# Altium schematic sheet ad_1.schdoc
size A3
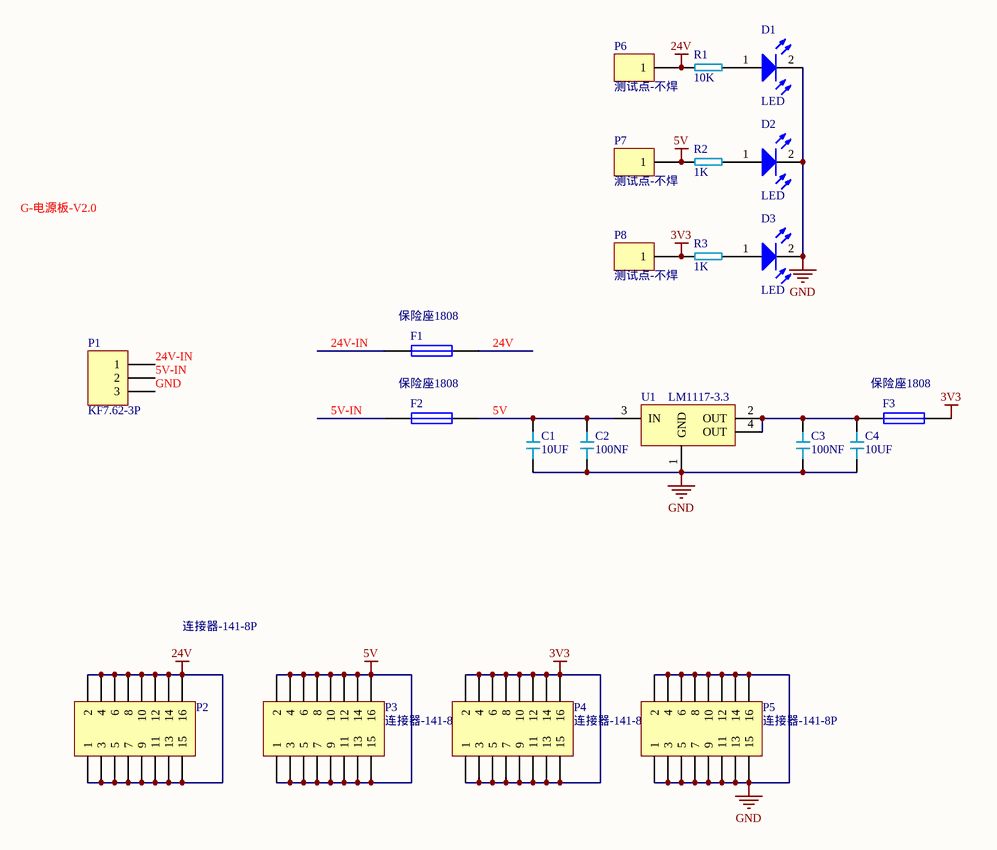
[diagram p0: ad_1.schdoc]

## Parts
C1  10UF  [C0603]
C2  100NF  [C0603]
C3  100NF  [C0603]
C4  10UF  [C0603]
D1  LED  [LED0603]
D2  LED  [LED0603]
D3  LED  [LED0603]
F1  保险座1808  [F1808-ZUO]
F2  保险座1808  [F1808-ZUO]
F3  保险座1808  [F1808-ZUO]
P1  KF7.62-3P  [KF7620-3P]
P2  连接器-141-8P  [141V-8P]
P3  连接器-141-8P  [141V-8P]
P4  连接器-141-8P  [141V-8P]
P5  连接器-141-8P  [141V-8P]
P6  测试点-不焊  [test]
P7  测试点-不焊  [test]
P8  测试点-不焊  [test]
R1  10K  [R0603]
R2  1K  [R0603]
R3  1K  [R0603]
U1  LM1117-3.3  [SOT223]

## Nets
3V3: F3.2 P4.1 P4.2 P4.3 P4.4 P4.5 P4.6 P4.7 P4.8 P4.9 P4.10 P4.11 P4.12 P4.13 P4.14 P4.15 P4.16 P8.1 R3.1
5V: C1.2 C2.2 F2.2 P3.1 P3.2 P3.3 P3.4 P3.5 P3.6 P3.7 P3.8 P3.9 P3.10 P3.11 P3.12 P3.13 P3.14 P3.15 P3.16 P7.1 R2.1 U1.3(IN)
24V: F1.2 P2.1 P2.2 P2.3 P2.4 P2.5 P2.6 P2.7 P2.8 P2.9 P2.10 P2.11 P2.12 P2.13 P2.14 P2.15 P2.16 P6.1 R1.1
GND: C1.1 C2.1 C3.1 C4.1 D1.2(K) D2.2(K) D3.2(K) P1.3 P5.1 P5.2 P5.3 P5.4 P5.5 P5.6 P5.7 P5.8 P5.9 P5.10 P5.11 P5.12 P5.13 P5.14 P5.15 P5.16 U1.1(GND)
5V-IN: F2.1 P1.2
24V-IN: F1.1 P1.1
NetC3_2: C3.2 C4.2 F3.1 U1.2(OUT) U1.4(OUT)
NetD1_1: D1.1(A) R1.2
NetD2_1: D2.1(A) R2.2
NetD3_1: D3.1(A) R3.2

## Notes on the sheet
- Labels drawn without touching a wire or pin: G-电源板-V2.0

## Library data of the parts
C1-C4 = C0603: 贴片电容
D1-D3 = LED0603: Published: 8-Jun-2000; LatestRevisionDate: 08-Jul-2005; LatestRevisionNote: Mech Layer 1 removed.; PackageReference: LED-0; Publisher: Altium Limited; PackageDescription: LED; 2 Leads
F1-F3 = Fuse0805: 保险座; Published: 8-Jun-2000; LatestRevisionDate: 17-Jul-2002; LatestRevisionNote: Re-released for DXP Platform.; PackageReference: PIN-W2/E2.8; Publisher: Altium Limited; PackageDescription: Thru-Hole; 2 Leads
P1 = SIP3: 连接器; LatestRevisionDate: 17-Jul-2002; LatestRevisionNote: Re-released for DXP Platform.; Publisher: Altium Limited
P2-P5 = DIC16: 连接器; LatestRevisionDate: 17-Jul-2002; LatestRevisionNote: Re-released for DXP Platform.; Publisher: Altium Limited
P6-P8 = SIP1: 连接器; LatestRevisionDate: 17-Jul-2002; LatestRevisionNote: Re-released for DXP Platform.; Publisher: Altium Limited
R1-R3 = R-0603: 贴片电阻
U1 = 1117: 芯片; LatestRevisionDate: 17-Jul-2002; LatestRevisionNote: Re-released for DXP Platform.; Publisher: Altium Limited